# Altium project PCB_Project.PrjPcb
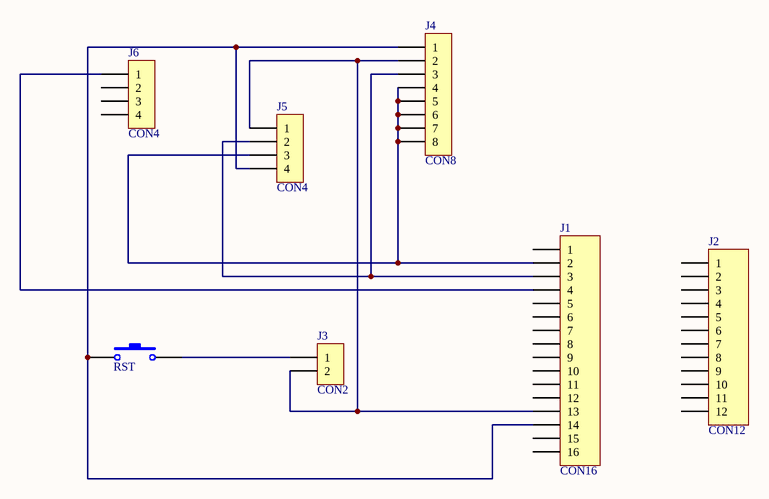
[diagram p0: Sheet2.SchDoc]
1 sheet, 7 parts. Net scope: global (net labels, ports and power ports of the same name join across sheets).
Board file: PCB2.PcbDoc

## Sheet Sheet2.SchDoc
size A4; SheetNumber: 1; SheetTotal: 1

### Parts
J1  CON16  [HDR1X16]
J2  CON12  [HDR1X12]
J3  CON2  [HDR1X2]
J4  CON8  [HDR1X8]
J5  CON4  [HDR1X4]
J6  CON4  [HDR1X4]
RST  SW-PB  [KEY-K2]  (value not drawn)

### Nets
NetJ1_2: J1.2 J4.4 J4.5 J4.6 J4.7 J4.8 J5.3
NetJ1_3: J1.3 J4.3 J5.2
NetJ1_4: J1.4 J6.1
NetJ1_13: J1.13 J3.2 J4.2 J5.1
NetJ1_14: J1.14 J4.1 J5.4 RST.1
NetJ3_1: J3.1 RST.2

Not connected (* = marked no-connect by the designer): J1 1 5 6 7 8 9 10 11 12 15 16; J2 1 2 3 4 5 6 7 8 9 10 11 12; J6 2 3 4

### Library data of the parts
J1 = CON16: Connector
J2 = CON12: Connector
J3 = CON2: Connector
J4 = CON8: Connector
J5 J6 = CON4: Connector
RST = SW-PB: Switch; Manufacturer: Generic Components; Published: 1999